# EAGLE design driver_board_v6_6tubes (EAGLE 6.5.0)
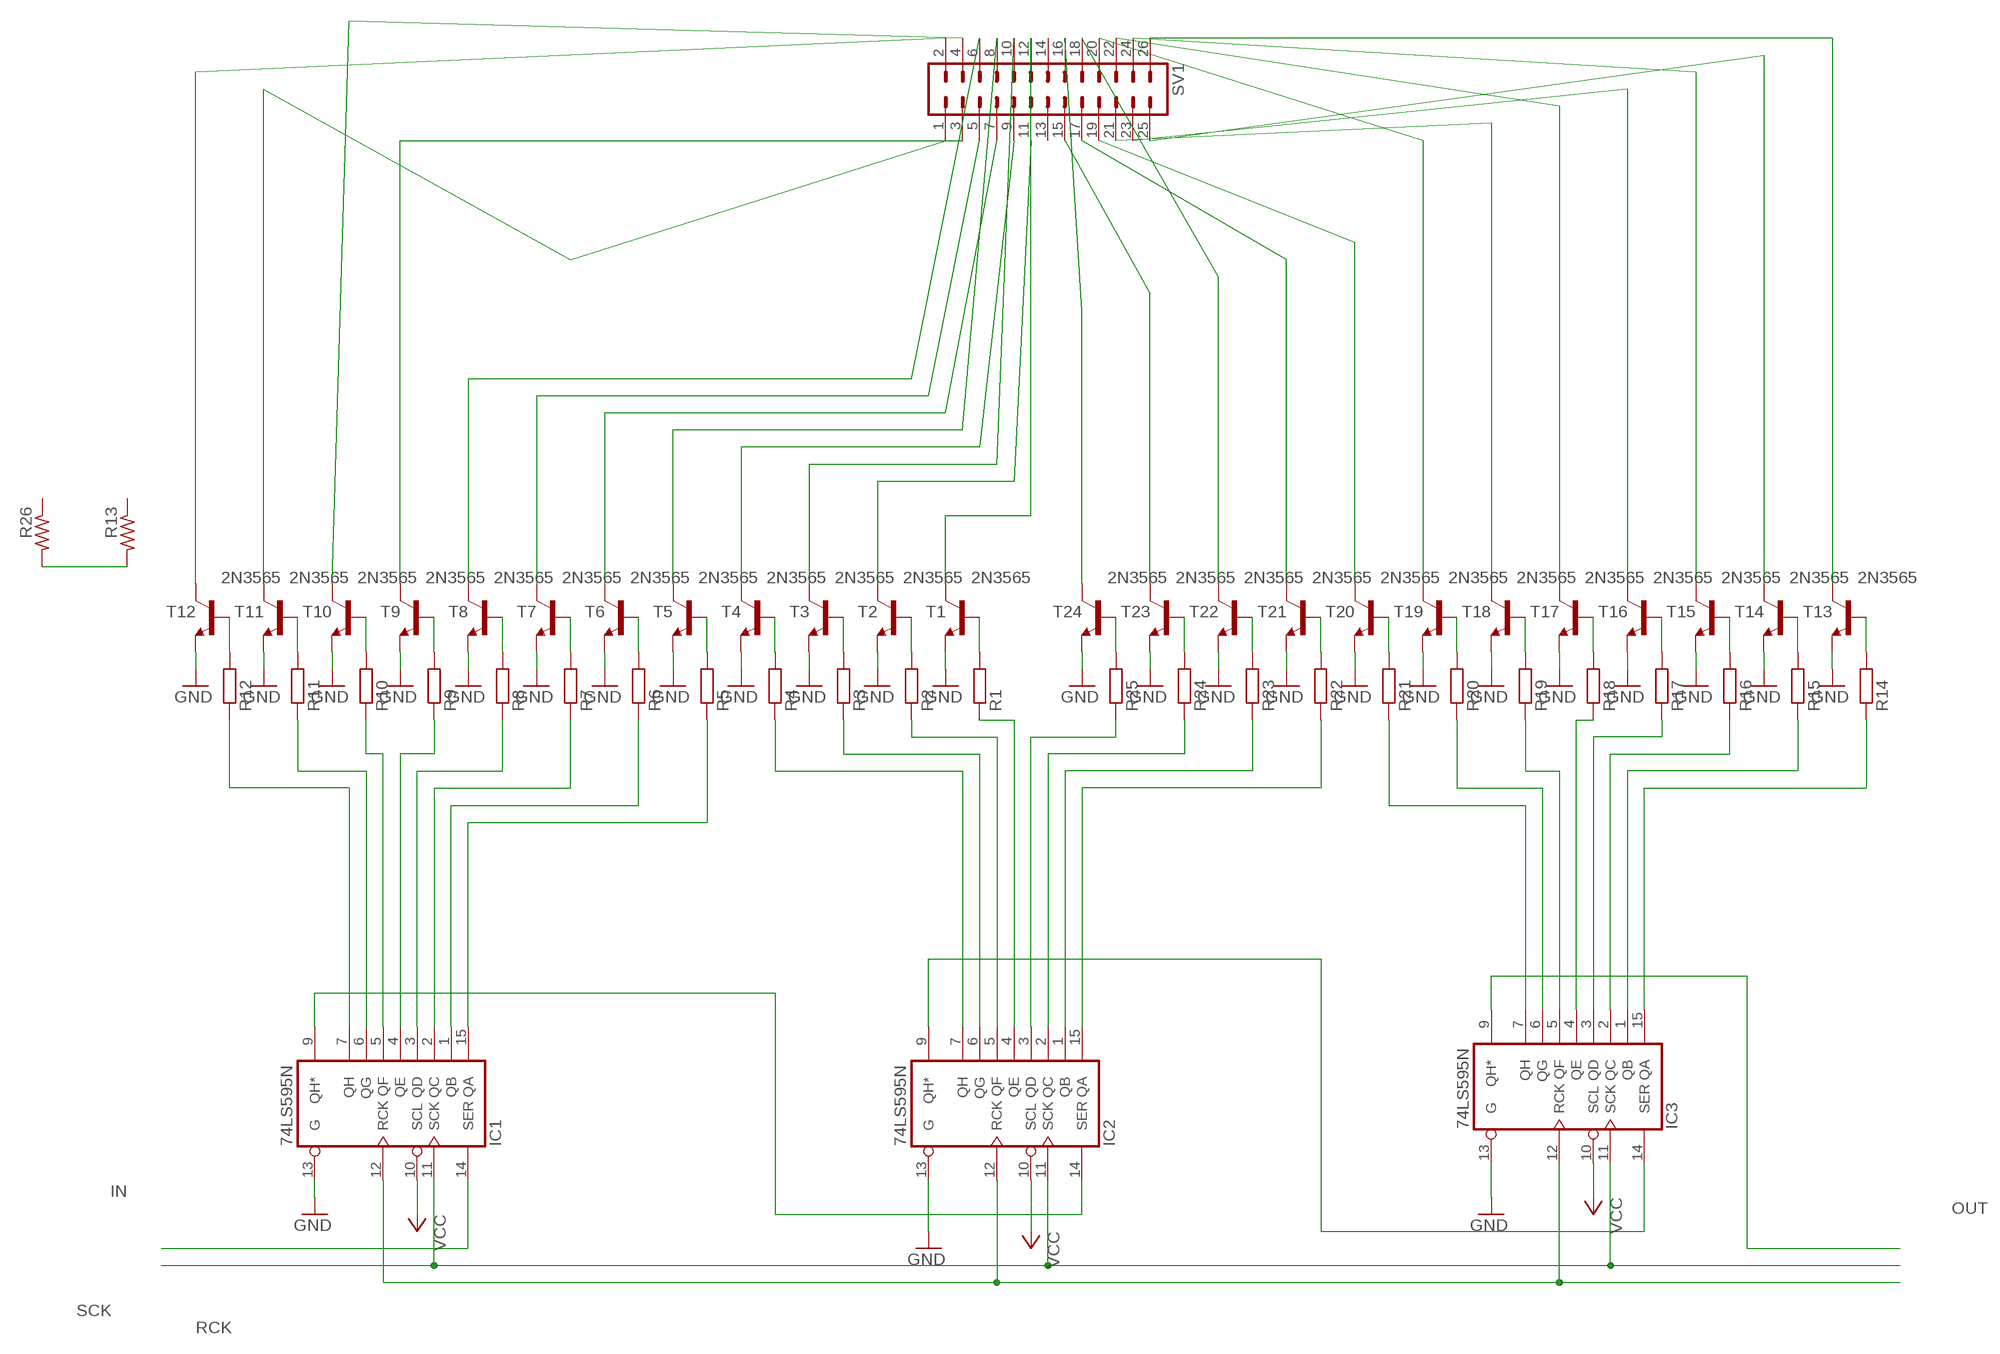
[diagram p0: schematic, sheet 1, part 1 of 2]
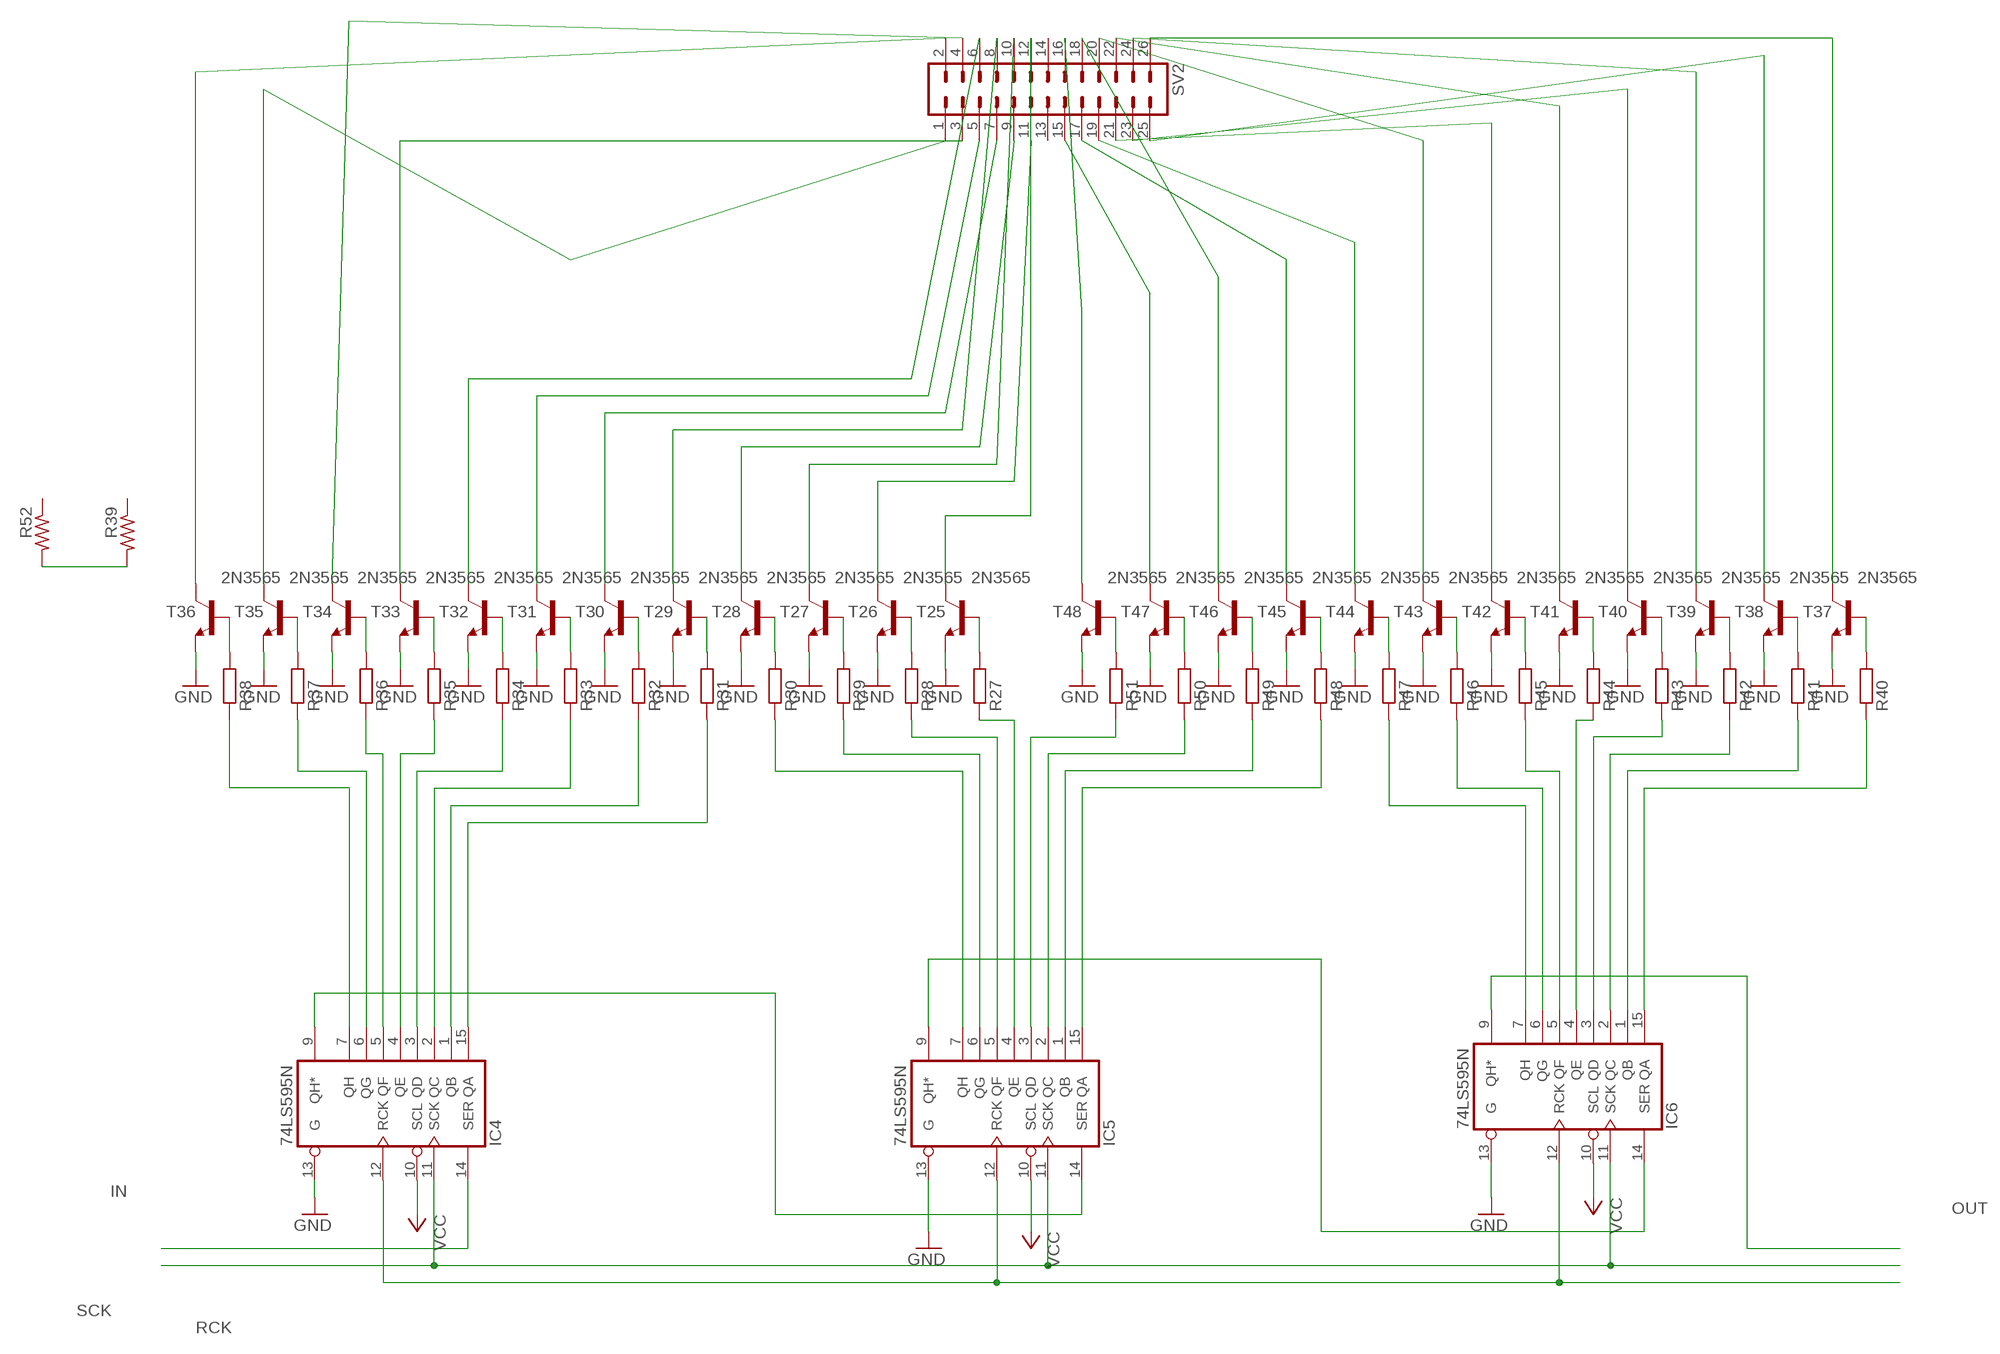
[diagram p1: schematic, sheet 1, part 2 of 2]

## Parts
IC1  74LS595N  [DIL16]
IC2  74LS595N  [DIL16]
IC3  74LS595N  [DIL16]
IC4  74LS595N  [DIL16]
IC5  74LS595N  [DIL16]
IC6  74LS595N  [DIL16]
R1  R-EU_0207/2V  [0207/2V]
R2  R-EU_0207/2V  [0207/2V]
R3  R-EU_0207/2V  [0207/2V]
R4  R-EU_0207/2V  [0207/2V]
R5  R-EU_0207/2V  [0207/2V]
R6  R-EU_0207/2V  [0207/2V]
R7  R-EU_0207/2V  [0207/2V]
R8  R-EU_0207/2V  [0207/2V]
R9  R-EU_0207/2V  [0207/2V]
R10  R-EU_0207/2V  [0207/2V]
R11  R-EU_0207/2V  [0207/2V]
R12  R-EU_0207/2V  [0207/2V]
R13  R-US_0204/7  [0204/7]
R14  R-EU_0207/2V  [0207/2V]
R15  R-EU_0207/2V  [0207/2V]
R16  R-EU_0207/2V  [0207/2V]
R17  R-EU_0207/2V  [0207/2V]
R18  R-EU_0207/2V  [0207/2V]
R19  R-EU_0207/2V  [0207/2V]
R20  R-EU_0207/2V  [0207/2V]
R21  R-EU_0207/2V  [0207/2V]
R22  R-EU_0207/2V  [0207/2V]
R23  R-EU_0207/2V  [0207/2V]
R24  R-EU_0207/2V  [0207/2V]
R25  R-EU_0207/2V  [0207/2V]
R26  R-US_0204/7  [0204/7]
R27  R-EU_0207/2V  [0207/2V]
R28  R-EU_0207/2V  [0207/2V]
R29  R-EU_0207/2V  [0207/2V]
R30  R-EU_0207/2V  [0207/2V]
R31  R-EU_0207/2V  [0207/2V]
R32  R-EU_0207/2V  [0207/2V]
R33  R-EU_0207/2V  [0207/2V]
R34  R-EU_0207/2V  [0207/2V]
R35  R-EU_0207/2V  [0207/2V]
R36  R-EU_0207/2V  [0207/2V]
R37  R-EU_0207/2V  [0207/2V]
R38  R-EU_0207/2V  [0207/2V]
R39  R-US_0204/7  [0204/7]
R40  R-EU_0207/2V  [0207/2V]
R41  R-EU_0207/2V  [0207/2V]
R42  R-EU_0207/2V  [0207/2V]
R43  R-EU_0207/2V  [0207/2V]
R44  R-EU_0207/2V  [0207/2V]
R45  R-EU_0207/2V  [0207/2V]
R46  R-EU_0207/2V  [0207/2V]
R47  R-EU_0207/2V  [0207/2V]
R48  R-EU_0207/2V  [0207/2V]
R49  R-EU_0207/2V  [0207/2V]
R50  R-EU_0207/2V  [0207/2V]
R51  R-EU_0207/2V  [0207/2V]
R52  R-US_0204/7  [0204/7]
SV1  MA13-2  [MA13-2]
SV2  MA13-2  [MA13-2]
T1  2N3565  [TO92]
T2  2N3565  [TO92]
T3  2N3565  [TO92]
T4  2N3565  [TO92]
T5  2N3565  [TO92]
T6  2N3565  [TO92]
T7  2N3565  [TO92]
T8  2N3565  [TO92]
T9  2N3565  [TO92]
T10  2N3565  [TO92]
T11  2N3565  [TO92]
T12  2N3565  [TO92]
T13  2N3565  [TO92]
T14  2N3565  [TO92]
T15  2N3565  [TO92]
T16  2N3565  [TO92]
T17  2N3565  [TO92]
T18  2N3565  [TO92]
T19  2N3565  [TO92]
T20  2N3565  [TO92]
T21  2N3565  [TO92]
T22  2N3565  [TO92]
T23  2N3565  [TO92]
T24  2N3565  [TO92]
T25  2N3565  [TO92]
T26  2N3565  [TO92]
T27  2N3565  [TO92]
T28  2N3565  [TO92]
T29  2N3565  [TO92]
T30  2N3565  [TO92]
T31  2N3565  [TO92]
T32  2N3565  [TO92]
T33  2N3565  [TO92]
T34  2N3565  [TO92]
T35  2N3565  [TO92]
T36  2N3565  [TO92]
T37  2N3565  [TO92]
T38  2N3565  [TO92]
T39  2N3565  [TO92]
T40  2N3565  [TO92]
T41  2N3565  [TO92]
T42  2N3565  [TO92]
T43  2N3565  [TO92]
T44  2N3565  [TO92]
T45  2N3565  [TO92]
T46  2N3565  [TO92]
T47  2N3565  [TO92]
T48  2N3565  [TO92]

## Nets
GND: IC1.13(G) IC2.13(G) IC3.13(G) IC4.13(G) IC5.13(G) IC6.13(G) T1.3(E) T2.3(E) T3.3(E) T4.3(E) T5.3(E) T6.3(E) T7.3(E) T8.3(E) T9.3(E) T10.3(E) T11.3(E) T12.3(E) T13.3(E) T14.3(E) T15.3(E) T16.3(E) T17.3(E) T18.3(E) T19.3(E) T20.3(E) T21.3(E) T22.3(E) T23.3(E) T24.3(E) T25.3(E) T26.3(E) T27.3(E) T28.3(E) T29.3(E) T30.3(E) T31.3(E) T32.3(E) T33.3(E) T34.3(E) T35.3(E) T36.3(E) T37.3(E) T38.3(E) T39.3(E) T40.3(E) T41.3(E) T42.3(E) T43.3(E) T44.3(E) T45.3(E) T46.3(E) T47.3(E) T48.3(E)
IN: IC1.14(SER) IC4.14(SER)
N$1: R12.2 T12.2(B)
N$2: R11.2 T11.2(B)
N$3: R10.2 T10.2(B)
N$4: R9.2 T9.2(B)
N$5: R8.2 T8.2(B)
N$6: R7.2 T7.2(B)
N$7: R6.2 T6.2(B)
N$8: R5.2 T5.2(B)
N$9: R4.2 T4.2(B)
N$10: R3.2 T3.2(B)
N$11: R2.2 T2.2(B)
N$12: R1.2 T1.2(B)
N$13: SV1.12 T1.1(C)
N$14: R38.2 T36.2(B)
N$15: R37.2 T35.2(B)
N$16: SV1.3 T9.1(C)
N$17: SV1.6 T8.1(C)
N$18: SV1.5 T7.1(C)
N$19: R36.2 T34.2(B)
N$20: SV1.11 T2.1(C)
N$21: SV1.10 T3.1(C)
N$22: SV1.7 T6.1(C)
N$23: SV1.8 T5.1(C)
N$24: SV1.9 T4.1(C)
N$25: R35.2 T33.2(B)
N$26: R25.2 T24.2(B)
N$27: R24.2 T23.2(B)
N$28: R23.2 T22.2(B)
N$29: R22.2 T21.2(B)
N$30: R21.2 T20.2(B)
N$31: R20.2 T19.2(B)
N$32: R19.2 T18.2(B)
N$33: R18.2 T17.2(B)
N$34: R17.2 T16.2(B)
N$35: R16.2 T15.2(B)
N$36: R15.2 T14.2(B)
N$37: R14.2 T13.2(B)
N$38: SV1.16 T24.1(C)
N$39: SV1.15 T23.1(C)
N$40: SV1.18 T22.1(C)
N$41: SV1.17 T21.1(C)
N$42: SV1.19 T20.1(C)
N$43: SV1.20 T19.1(C)
N$44: SV1.26 T13.1(C)
N$45: SV1.25 T14.1(C)
N$46: SV1.24 T15.1(C)
N$47: SV1.21 T18.1(C)
N$48: SV1.22 T17.1(C)
N$49: SV1.23 T16.1(C)
N$50: R13.2 R26.2
N$51: R34.2 T32.2(B)
N$52: IC1.9(QH*) IC2.14(SER)
N$53: IC2.9(QH*) IC3.14(SER)
N$54: R33.2 T31.2(B)
N$55: R32.2 T30.2(B)
N$57: SV1.2 T12.1(C)
N$58: R31.2 T29.2(B)
N$59: R30.2 T28.2(B)
N$60: SV1.1 T11.1(C)
N$61: SV1.4 T10.1(C)
N$62: R29.2 T27.2(B)
N$63: R28.2 T26.2(B)
N$64: R27.2 T25.2(B)
N$65: SV2.3 T33.1(C)
N$66: SV2.6 T32.1(C)
N$67: SV2.5 T31.1(C)
N$68: SV2.11 T26.1(C)
N$69: SV2.10 T27.1(C)
N$70: SV2.7 T30.1(C)
N$71: SV2.8 T29.1(C)
N$72: SV2.9 T28.1(C)
N$73: R51.2 T48.2(B)
N$74: R50.2 T47.2(B)
N$75: IC1.7(QH) R12.1
N$76: IC1.6(QG) R11.1
N$77: IC1.5(QF) R10.1
N$78: IC1.4(QE) R9.1
N$79: IC1.3(QD) R8.1
N$80: IC1.2(QC) R7.1
N$81: IC1.1(QB) R6.1
N$82: IC1.15(QA) R5.1
N$83: R49.2 T46.2(B)
N$84: IC2.7(QH) R4.1
N$85: IC2.6(QG) R3.1
N$86: IC2.5(QF) R2.1
N$87: IC2.4(QE) R1.1
N$88: IC2.3(QD) R25.1
N$89: IC2.2(QC) R24.1
N$90: IC2.1(QB) R23.1
N$91: IC2.15(QA) R22.1
N$92: IC3.7(QH) R21.1
N$93: IC3.6(QG) R20.1
N$94: IC3.5(QF) R19.1
N$95: IC3.4(QE) R18.1
N$96: IC3.3(QD) R17.1
N$97: IC3.2(QC) R16.1
N$98: IC3.1(QB) R15.1
N$99: IC3.15(QA) R14.1
N$100: R48.2 T45.2(B)
N$101: R47.2 T44.2(B)
N$102: R46.2 T43.2(B)
N$103: R45.2 T42.2(B)
N$104: R44.2 T41.2(B)
N$105: R43.2 T40.2(B)
N$106: R42.2 T39.2(B)
N$107: R41.2 T38.2(B)
N$108: R40.2 T37.2(B)
N$109: SV2.16 T48.1(C)
N$110: SV2.15 T47.1(C)
N$111: SV2.18 T46.1(C)
N$112: SV2.17 T45.1(C)
N$113: SV2.19 T44.1(C)
N$114: SV2.20 T43.1(C)
N$115: SV2.26 T37.1(C)
N$116: SV2.25 T38.1(C)
N$117: SV2.24 T39.1(C)
N$118: SV2.21 T42.1(C)
N$119: SV2.22 T41.1(C)
N$120: SV2.23 T40.1(C)
N$121: IC4.7(QH) R38.1
N$122: IC4.6(QG) R37.1
N$123: IC4.5(QF) R36.1
N$124: IC4.4(QE) R35.1
N$125: IC4.3(QD) R34.1
N$126: IC4.2(QC) R33.1
N$127: IC4.1(QB) R32.1
N$128: IC4.15(QA) R31.1
N$129: IC5.7(QH) R30.1
N$130: IC5.6(QG) R29.1
N$131: IC5.5(QF) R28.1
N$132: IC5.4(QE) R27.1
N$133: IC5.3(QD) R51.1
N$134: IC5.2(QC) R50.1
N$135: IC5.1(QB) R49.1
N$136: IC5.15(QA) R48.1
N$137: IC6.7(QH) R47.1
N$138: IC6.6(QG) R46.1
N$139: IC6.5(QF) R45.1
N$140: IC6.4(QE) R44.1
N$141: IC6.3(QD) R43.1
N$142: IC6.2(QC) R42.1
N$143: IC6.1(QB) R41.1
N$144: IC6.15(QA) R40.1
N$145: R39.2 R52.2
N$146: IC4.9(QH*) IC5.14(SER)
N$147: IC5.9(QH*) IC6.14(SER)
N$148: SV2.12 T25.1(C)
N$149: SV2.2 T36.1(C)
N$150: SV2.1 T35.1(C)
N$151: SV2.4 T34.1(C)
OUT: IC3.9(QH*) IC6.9(QH*)
RCK: IC1.12(RCK) IC2.12(RCK) IC3.12(RCK) IC4.12(RCK) IC5.12(RCK) IC6.12(RCK)
SCK: IC1.11(SCK) IC2.11(SCK) IC3.11(SCK) IC4.11(SCK) IC5.11(SCK) IC6.11(SCK)
VCC: IC1.10(SCL) IC2.10(SCL) IC3.10(SCL) IC4.10(SCL) IC5.10(SCL) IC6.10(SCL)
Unconnected: R13.1 R26.1 R39.1 R52.1 SV1.13 SV1.14 SV2.13 SV2.14

## Power pins joined to a net without a drawn wire
GND: IC1.8(GND) IC2.8(GND) IC3.8(GND) IC4.8(GND) IC5.8(GND) IC6.8(GND)
VCC: IC1.16(VCC) IC2.16(VCC) IC3.16(VCC) IC4.16(VCC) IC5.16(VCC) IC6.16(VCC)

## Library data of the parts
IC1-IC6 = 74xx-us:74*595: 8-bit SHIFT REGISTER, output latch
R1-R12 R14-R25 R27-R38 R40-R51 = resistor:R-EU_: RESISTOR, European symbol
R13 R26 R39 R52 = resistor:R-US_: RESISTOR, American symbol
SV1 SV2 = con-lstb:MA13-2: PIN HEADER; OC_FARNELL: unknown; OC_NEWARK: unknown
T1-T48 = transistor:2N3565: NPN TRANSISTOR

## Board
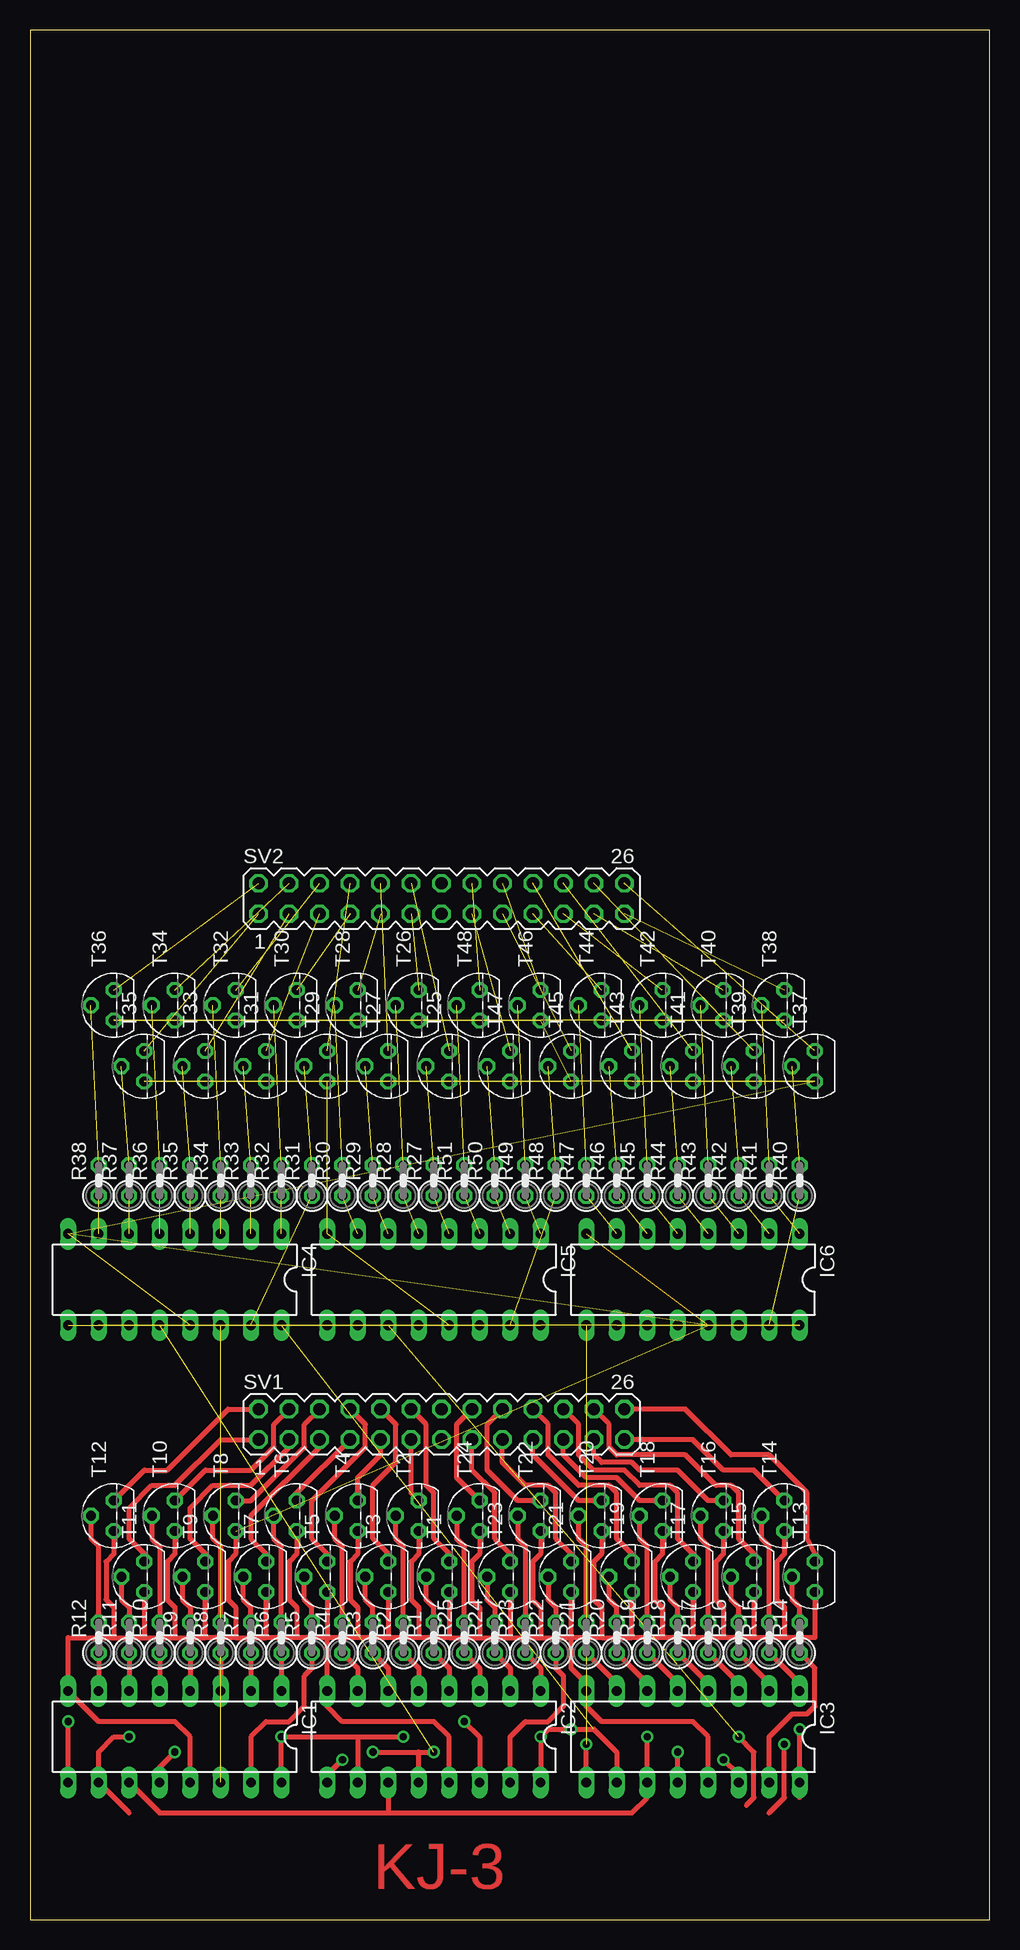
[diagram p2: board, top side]
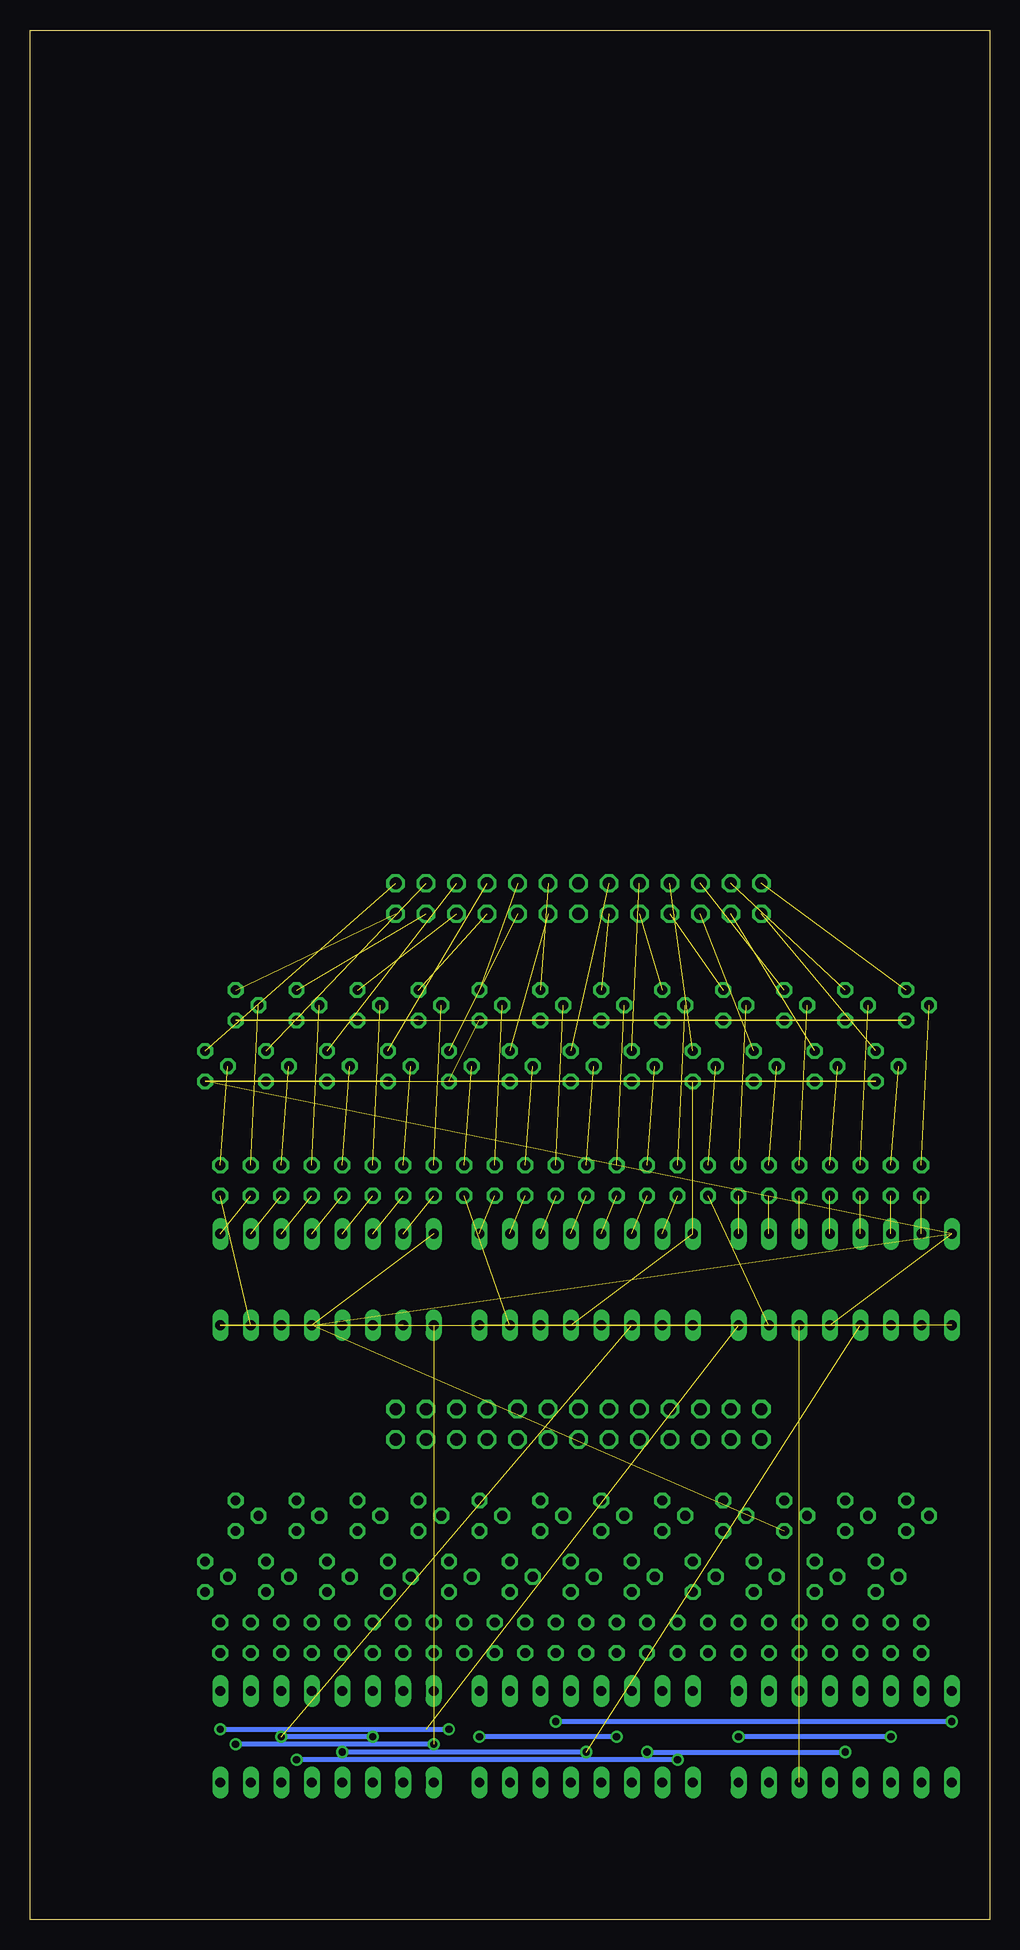
[diagram p3: board, bottom side, seen from below]

Size 80 x 157.47 mm. Coordinates in mm from the lower left corner, seen from the top.
Outline: 0,0 80,0 80,157.47 0,157.47 0,0
Copper layers (1*16): Top 0.035mm / dielectric 1.5mm / Bottom 0.035mm
Design rules "default": minimum track width 10mil, minimum drill 24mil, track to track 8mil, track to pad 8mil, pad to pad 8mil, via to via 8mil, smd to smd 8mil, copper to edge 40mil, drill to drill 8mil, minimum pad ring 10mil, minimum via ring 8mil, stop-mask expansion 4mil, vias tented up to drill 0mil, thermal gap 10mil

### Footprints (pad centres in the part's own frame; a part is rotated, then mirrored left to right if it is on the bottom)
DIL16 = drill 0.813 long: 1 -8.89,-3.81; 2 -6.35,-3.81; 3 -3.81,-3.81; 4 -1.27,-3.81; 5 1.27,-3.81; 6 3.81,-3.81; 7 6.35,-3.81; 8 8.89,-3.81; 9 8.89,3.81; 10 6.35,3.81; 11 3.81,3.81; 12 1.27,3.81; 13 -1.27,3.81; 14 -3.81,3.81; 15 -6.35,3.81; 16 -8.89,3.81
0207/2V = drill 0.813 octagon: 1 -1.27,0; 2 1.27,0
0204/7 = drill 0.813 octagon: 1 -3.81,0; 2 3.81,0
MA13-2 = drill 1.016 octagon: 1 -15.24,-1.27; 2 -15.24,1.27; 3 -12.7,-1.27; 4 -12.7,1.27; 5 -10.16,-1.27; 6 -10.16,1.27; 7 -7.62,-1.27; 8 -7.62,1.27; 9 -5.08,-1.27; 10 -5.08,1.27; 11 -2.54,-1.27; 12 -2.54,1.27; 13 0,-1.27; 14 0,1.27; 15 2.54,-1.27; 16 2.54,1.27; 17 5.08,-1.27; 18 5.08,1.27; 19 7.62,-1.27; 20 7.62,1.27; 21 10.16,-1.27; 22 10.16,1.27; 23 12.7,-1.27; 24 12.7,1.27; 25 15.24,-1.27; 26 15.24,1.27
TO92 = drill 0.813 octagon: 1 1.27,0; 2 0,1.905; 3 -1.27,0

### Placement (x,y rotation side)
IC1  12.06,15.24 180 top
IC2  33.66,15.24 180 top
IC3  55.24,15.24 180 top
IC4  12.06,53.34 180 top
IC5  33.66,53.34 180 top
IC6  55.24,53.34 180 top
R1  33.66,23.49 90 top
R2  31.11,23.49 90 top
R3  28.57,23.49 90 top
R4  26.04,23.49 90 top
R5  23.5,23.49 90 top
R6  20.95,23.49 90 top
R7  18.41,23.49 90 top
R8  15.88,23.49 90 top
R9  13.34,23.49 90 top
R10  10.79,23.49 90 top
R11  8.26,23.49 90 top
R12  5.71,23.49 90 top
R13  -8.26,33.65 270 top  (outside the outline)
R14  64.14,23.49 90 top
R15  61.59,23.49 90 top
R16  59.05,23.49 90 top
R17  56.52,23.49 90 top
R18  53.98,23.49 90 top
R19  51.44,23.49 90 top
R20  48.9,23.49 90 top
R21  46.35,23.49 90 top
R22  43.81,23.49 90 top
R23  41.27,23.49 90 top
R24  38.73,23.49 90 top
R25  36.2,23.49 90 top
R26  -11.43,33.66 270 top  (outside the outline)
R27  33.66,61.59 90 top
R28  31.11,61.59 90 top
R29  28.57,61.59 90 top
R30  26.04,61.59 90 top
R31  23.5,61.59 90 top
R32  20.95,61.59 90 top
R33  18.41,61.59 90 top
R34  15.88,61.59 90 top
R35  13.34,61.59 90 top
R36  10.79,61.59 90 top
R37  8.26,61.59 90 top
R38  5.71,61.59 90 top
R39  -11.43,80.01 270 top  (outside the outline)
R40  64.14,61.59 90 top
R41  61.59,61.59 90 top
R42  59.05,61.59 90 top
R43  56.52,61.59 90 top
R44  53.98,61.59 90 top
R45  51.44,61.59 90 top
R46  48.9,61.59 90 top
R47  46.35,61.59 90 top
R48  43.81,61.59 90 top
R49  41.27,61.59 90 top
R50  38.73,61.59 90 top
R51  36.2,61.59 90 top
R52  -15.24,80.64 270 top  (outside the outline)
SV1  34.29,41.27 0 top
SV2  34.29,85.09 0 top
T1  34.92,28.58 90 top
T2  32.38,33.66 90 top
T3  29.84,28.58 90 top
T4  27.3,33.66 90 top
T5  24.77,28.58 90 top
T6  22.23,33.66 90 top
T7  19.68,28.58 90 top
T8  17.14,33.66 90 top
T9  14.61,28.58 90 top
T10  12.06,33.66 90 top
T11  9.53,28.58 90 top
T12  6.99,33.66 90 top
T13  65.41,28.58 90 top
T14  62.87,33.66 90 top
T15  60.33,28.58 90 top
T16  57.78,33.66 90 top
T17  55.24,28.58 90 top
T18  52.7,33.66 90 top
T19  50.16,28.58 90 top
T20  47.62,33.66 90 top
T21  45.09,28.58 90 top
T22  42.55,33.66 90 top
T23  40.01,28.58 90 top
T24  37.47,33.66 90 top
T25  34.92,71.12 90 top
T26  32.38,76.2 90 top
T27  29.84,71.12 90 top
T28  27.3,76.2 90 top
T29  24.77,71.12 90 top
T30  22.23,76.2 90 top
T31  19.68,71.12 90 top
T32  17.14,76.2 90 top
T33  14.61,71.12 90 top
T34  12.06,76.2 90 top
T35  9.53,71.12 90 top
T36  6.99,76.2 90 top
T37  65.41,71.12 90 top
T38  62.87,76.2 90 top
T39  60.33,71.12 90 top
T40  57.78,76.2 90 top
T41  55.24,71.12 90 top
T42  52.7,76.2 90 top
T43  50.16,71.12 90 top
T44  47.62,76.2 90 top
T45  45.09,71.12 90 top
T46  42.55,76.2 90 top
T47  40.01,71.12 90 top
T48  37.47,76.2 90 top

### Tracks (layer width: path | path; a pad name or v marks a point on that pad's centre or on a via)
GND  (30 unrouted)
  Top 0.406: T11.3 9.53,23.49 | 9.53,23.49 12.06,23.49 | 12.06,23.49 14.61,23.49 | 14.61,23.49 T9.3 | T10.3 12.06,30.48 11.43,29.84 11.43,26.67 12.06,26.04 12.06,23.49 | T12.3 6.99,30.48 6.35,29.84 6.35,26.67 6.99,26.04 6.99,23.49 | 6.99,23.49 9.53,23.49 | T8.3 17.14,30.48 16.51,29.84 16.51,26.67 17.14,26.04 17.14,23.49 | 17.14,23.49 19.68,23.49 | 19.68,23.49 T7.3 | T5.3 24.77,23.49 | 24.77,23.49 22.23,23.49 | 22.23,23.49 19.68,23.49 | T3.3 29.84,23.49 | 29.84,23.49 27.3,23.49 | 27.3,23.49 24.77,23.49 | 17.14,23.49 14.61,23.49 | 34.92,23.49 32.38,23.49 | 32.38,23.49 29.84,23.49 | T2.3 32.38,30.48 31.75,29.84 31.75,26.67 32.38,26.04 32.38,23.49 | T4.3 27.3,30.48 26.67,29.84 26.67,26.67 27.3,26.04 27.3,23.49 | T6.3 22.23,30.48 21.59,29.84 21.59,26.67 22.23,26.04 22.23,23.49 | T23.3 40.01,23.49 | 40.01,23.49 42.55,23.49 | 42.55,23.49 45.09,23.49 | 45.09,23.49 T21.3 | T22.3 42.55,30.48 41.91,29.84 41.91,26.67 42.55,26.04 42.55,23.49 | T24.3 37.47,30.48 36.83,29.84 36.83,26.67 37.47,26.04 37.47,23.49 | 37.47,23.49 40.01,23.49 | T20.3 47.62,30.48 46.99,29.84 46.99,26.67 47.62,26.04 47.62,23.49 | 47.62,23.49 50.16,23.49 | 50.16,23.49 T19.3 | T17.3 55.24,23.49 | 55.24,23.49 52.7,23.49 | 52.7,23.49 50.16,23.49 | T15.3 60.33,23.49 | 60.33,23.49 57.78,23.49 | 57.78,23.49 55.24,23.49 | 47.62,23.49 45.09,23.49 | T13.3 65.41,23.49 62.87,23.49 | 62.87,23.49 60.33,23.49 | T14.3 62.87,30.48 62.23,29.84 62.23,26.67 62.87,26.04 62.87,23.49 | T16.3 57.78,30.48 57.15,29.84 57.15,26.67 57.78,26.04 57.78,23.49 | T18.3 52.7,30.48 52.07,29.84 52.07,26.67 52.7,26.04 52.7,23.49 | 24.77,23.49 IC2.8 24.77,17.78 26.04,16.51 33.66,16.51 34.92,15.24 IC2.13
  Top 0.406: 45.09,23.49 45.09,20.95 46.35,19.69 IC3.8 46.35,17.78 47.62,16.51 55.24,16.51 56.52,15.24 IC3.13 | T1.3 34.92,23.49 | 34.92,23.49 37.47,23.49 | IC1.13 13.34,15.24 12.06,16.51 5.71,16.51 IC1.8 3.17,23.49 6.99,23.49
IN  (1 unrouted)
N$1
  Top 0.406: T12.2 5.08,31.75 5.71,31.12 R12.2
N$2
  Top 0.406: T11.2 7.62,26.67 8.26,26.04 R11.2
N$3
  Top 0.406: T10.2 10.16,31.75 10.79,31.12 R10.2
N$4
  Top 0.406: T9.2 12.7,26.67 13.34,26.04 R9.2
N$5
  Top 0.406: R8.2 15.88,31.12 15.24,31.75 T8.2
N$6
  Top 0.406: R7.2 18.41,26.04 17.78,26.67 T7.2
N$7
  Top 0.406: R6.2 20.95,31.12 20.32,31.75 T6.2
N$8
  Top 0.406: R5.2 23.5,26.04 22.86,26.67 T5.2
N$9
  Top 0.406: R4.2 26.04,31.12 25.4,31.75 T4.2
N$10
  Top 0.406: R3.2 28.57,26.04 27.94,26.67 T3.2
N$11
  Top 0.406: R2.2 31.11,31.12 30.48,31.75 T2.2
N$12
  Top 0.406: R1.2 33.66,26.04 33.02,26.67 T1.2
N$13
  Top 0.406: T1.1 34.92,30.48 33.66,31.75 33.66,35.56 33.02,36.2 33.02,41.27 SV1.12
N$14  (1 unrouted)
N$15  (1 unrouted)
N$16
  Top 0.406: T9.1 14.61,30.48 13.34,31.75 13.34,34.29 15.24,36.2 18.41,36.2 21.59,39.37 SV1.3
N$17
  Top 0.406: T8.1 18.41,34.92 22.86,39.37 22.86,41.27 SV1.6
N$18
  Top 0.406: T7.1 19.68,30.48 18.41,31.75 18.41,33.66 24.13,39.37 SV1.5
N$19  (1 unrouted)
N$20
  Top 0.406: T2.1 31.75,35.56 SV1.11
N$21
  Top 0.406: T3.1 29.84,30.48 28.57,31.75 28.57,36.2 30.48,38.1 30.48,41.27 SV1.10
N$22
  Top 0.406: T6.1 22.23,35.56 SV1.7
N$23
  Top 0.406: T5.1 24.77,30.48 23.5,31.75 23.5,34.92 27.94,39.37 27.94,41.27 SV1.8
N$24
  Top 0.406: T4.1 27.3,36.83 29.21,38.73 SV1.9
N$25  (1 unrouted)
N$26
  Top 0.406: T24.2 35.56,31.75 36.2,31.12 R25.2
N$27
  Top 0.406: T23.2 38.1,26.67 38.73,26.04 R24.2
N$28
  Top 0.406: T22.2 40.64,31.75 41.27,31.12 R23.2
N$29
  Top 0.406: T21.2 43.18,26.67 43.81,26.04 R22.2
N$30
  Top 0.406: R21.2 46.35,31.12 45.72,31.75 T20.2
N$31
  Top 0.406: R20.2 48.9,26.04 48.26,26.67 T19.2
N$32
  Top 0.406: R19.2 51.44,31.12 50.8,31.75 T18.2
N$33
  Top 0.406: R18.2 53.98,26.04 53.34,26.67 T17.2
N$34
  Top 0.406: R17.2 56.52,31.12 55.88,31.75 T16.2
N$35
  Top 0.406: R16.2 59.05,26.04 58.42,26.67 T15.2
N$36
  Top 0.406: R15.2 61.59,31.12 60.96,31.75 T14.2
N$37
  Top 0.406: R14.2 64.14,26.04 63.5,26.67 T13.2
N$38
  Top 0.406: T24.1 35.56,36.83 35.56,41.27 SV1.16
N$39
  Top 0.406: T23.1 40.01,30.48 38.73,31.75 38.73,35.56 36.83,37.47 SV1.15
N$40
  Top 0.406: T22.1 40.64,34.92 38.1,37.47 38.1,41.27 SV1.18
N$41
  Top 0.406: T21.1 45.09,30.48 43.81,31.75 43.81,35.56 43.18,36.2 41.27,36.2 39.37,38.1 SV1.17
N$42
  Top 0.406: T20.1 45.72,34.92 41.91,38.73 SV1.19
N$43
  Top 0.406: T19.1 50.16,30.48 48.9,31.75 48.9,35.56 48.26,36.2 45.72,36.2 43.18,38.73 43.18,41.27 SV1.20
N$44
  Top 0.406: T13.1 65.41,30.48 64.77,31.75 64.77,35.56 61.59,38.73 58.42,38.73 54.61,42.55 SV1.26
N$45
  Top 0.406: T14.1 60.33,37.47 57.78,37.47 55.24,40.01 SV1.25
N$46
  Top 0.406: T15.1 60.33,30.48 59.05,31.75 59.05,35.56 58.42,36.2 57.15,36.2 54.61,38.73 48.9,38.73 48.26,39.37 48.26,41.27 SV1.24
N$47
  Top 0.406: T18.1 50.8,34.92 48.9,36.83 46.35,36.83 44.45,38.73 SV1.21
N$48
  Top 0.406: T17.1 55.24,30.48 53.98,31.75 53.98,35.56 53.34,36.2 50.8,36.2 49.53,37.47 46.99,37.47 45.72,38.73 45.72,41.27 SV1.22
N$49
  Top 0.406: T16.1 56.52,34.92 53.98,37.47 50.8,37.47 50.16,38.1 47.62,38.1 46.99,38.73 SV1.23
N$50  (1 unrouted)
N$51  (1 unrouted)
N$52  (via drill 0.6)
  Top 0.406: IC1.9 v3.17,16.51 | v36.2,16.51 37.47,15.24 IC2.14
  Bottom 0.406: v3.17,16.51 v36.2,16.51
N$53  (via drill 0.6)
  Top 0.406: IC2.9 24.77,12.06 v26.04,13.34 | IC3.14 59.05,12.06 v57.78,13.34
  Bottom 0.406: v26.04,13.34 v57.78,13.34
N$54  (1 unrouted)
N$55  (1 unrouted)
N$57
  Top 0.406: T12.1 9.53,37.47 11.43,37.47 16.51,42.55 SV1.2
N$58  (1 unrouted)
N$59  (1 unrouted)
N$60
  Top 0.406: T11.1 9.53,30.48 8.26,31.75 8.26,34.29 10.16,36.2 12.06,36.2 15.88,40.01 SV1.1
N$61
  Top 0.406: T10.1 14.61,37.47 18.41,37.47 20.32,39.37 20.32,41.27 SV1.4
N$62  (1 unrouted)
N$63  (1 unrouted)
N$64  (1 unrouted)
N$65  (1 unrouted)
N$66  (1 unrouted)
N$67  (1 unrouted)
N$68  (1 unrouted)
N$69  (1 unrouted)
N$70  (1 unrouted)
N$71  (1 unrouted)
N$72  (1 unrouted)
N$73  (1 unrouted)
N$74  (1 unrouted)
N$75
  Top 0.406: R12.1 IC1.7
N$76
  Top 0.406: R11.1 IC1.6
N$77
  Top 0.406: R10.1 IC1.5
N$78
  Top 0.406: R9.1 IC1.4
N$79
  Top 0.406: R8.1 IC1.3
N$80
  Top 0.406: R7.1 IC1.2
N$81
  Top 0.406: R6.1 IC1.1
N$82
  Top 0.406: R5.1 23.5,20.95 22.86,20.32 22.86,17.78 21.59,16.51 19.68,16.51 18.41,15.24 IC1.15 18.41,12.7
N$83  (1 unrouted)
N$84
  Top 0.406: R4.1 27.3,20.95 IC2.7
N$85
  Top 0.406: R3.1 29.84,20.95 IC2.6
N$86
  Top 0.406: R2.1 32.38,20.95 IC2.5
N$87
  Top 0.406: R1.1 34.92,20.95 IC2.4
N$88
  Top 0.406: R25.1 37.47,20.95 IC2.3
N$89
  Top 0.406: R24.1 40.01,20.95 IC2.2
N$90
  Top 0.406: R23.1 42.55,20.95 IC2.1
N$91
  Top 0.406: R22.1 43.81,20.95 44.45,20.32 44.45,17.78 43.18,16.51 41.27,16.51 40.01,15.24 IC2.15
N$92
  Top 0.406: R21.1 48.9,19.69 IC3.7
N$93
  Top 0.406: R20.1 51.44,19.69 IC3.6
N$94
  Top 0.406: R19.1 53.98,19.69 IC3.5
N$95
  Top 0.406: R18.1 56.52,19.69 IC3.4
N$96
  Top 0.406: R17.1 59.05,19.69 IC3.3
N$97
  Top 0.406: R16.1 61.59,19.69 IC3.2
N$98
  Top 0.406: R15.1 64.14,19.69 IC3.1
N$99
  Top 0.406: R14.1 65.41,20.95 65.41,17.78 64.77,17.14 63.5,17.14 61.59,15.24 IC3.15
N$100  (1 unrouted)
N$101  (1 unrouted)
N$102  (1 unrouted)
N$103  (1 unrouted)
N$104  (1 unrouted)
N$105  (1 unrouted)
N$106  (1 unrouted)
N$107  (1 unrouted)
N$108  (1 unrouted)
N$109  (1 unrouted)
N$110  (1 unrouted)
N$111  (1 unrouted)
N$112  (1 unrouted)
N$113  (1 unrouted)
N$114  (1 unrouted)
N$115  (1 unrouted)
N$116  (1 unrouted)
N$117  (1 unrouted)
N$118  (1 unrouted)
N$119  (1 unrouted)
N$120  (1 unrouted)
N$121  (1 unrouted)
N$122  (1 unrouted)
N$123  (1 unrouted)
N$124  (1 unrouted)
N$125  (1 unrouted)
N$126  (1 unrouted)
N$127  (1 unrouted)
N$128  (1 unrouted)
N$129  (1 unrouted)
N$130  (1 unrouted)
N$131  (1 unrouted)
N$132  (1 unrouted)
N$133  (1 unrouted)
N$134  (1 unrouted)
N$135  (1 unrouted)
N$136  (1 unrouted)
N$137  (1 unrouted)
N$138  (1 unrouted)
N$139  (1 unrouted)
N$140  (1 unrouted)
N$141  (1 unrouted)
N$142  (1 unrouted)
N$143  (1 unrouted)
N$144  (1 unrouted)
N$145  (1 unrouted)
N$146  (1 unrouted)
N$147  (1 unrouted)
N$148  (1 unrouted)
N$149  (1 unrouted)
N$150  (1 unrouted)
N$151  (1 unrouted)
OUT  (via drill 0.6)  (1 unrouted)
  Top 0.406: IC3.9 v46.35,14.61 | v62.87,14.61 62.87,10.16 61.59,8.89
  Bottom 0.406: v46.35,14.61 v62.87,14.61
RCK  (via drill 0.6)  (3 unrouted)
  Top 0.406: IC1.12 10.79,12.7 v12.06,13.97 | IC2.12 32.38,13.97 | v28.57,13.97 32.38,13.97 | 32.38,13.97 v33.66,13.97 | IC3.12 v53.98,13.97
  Bottom 0.406: v28.57,13.97 v12.06,13.97 | v33.66,13.97 v53.98,13.97
SCK  (via drill 0.6)  (3 unrouted)
  Top 0.406: IC1.11 10.79,8.89 29.84,8.89 | IC2.11 29.84,8.89 | 29.84,8.89 50.16,8.89 51.44,10.16 IC3.11 v51.44,15.24 | v59.05,15.24 60.33,13.97 60.33,10.16 59.69,9.53
  Bottom 0.406: v51.44,15.24 v59.05,15.24
VCC  (via drill 0.6)  (6 unrouted)
  Top 0.406: 64.14,10.16 IC3.16 v64.14,15.88 | IC1.16 v20.95,15.24 | v20.95,15.24 26.04,15.24 | 27.3,15.24 IC2.10 | IC2.16 v42.55,15.24 43.18,15.88 v45.09,15.88 46.99,15.88 48.9,13.97 IC3.10 | 8.26,8.89 IC1.10 5.71,13.97 6.99,15.24 v8.26,15.24 | v20.95,15.24 27.3,15.24 | 27.3,15.24 v31.11,15.24
  Bottom 0.406: v8.26,15.24 v20.95,15.24 | v31.11,15.24 v42.55,15.24 | v64.14,15.88 v45.09,15.88

### Text on the board
Top: KJ-3